# Altium project Crawler_Brain.PrjPcb
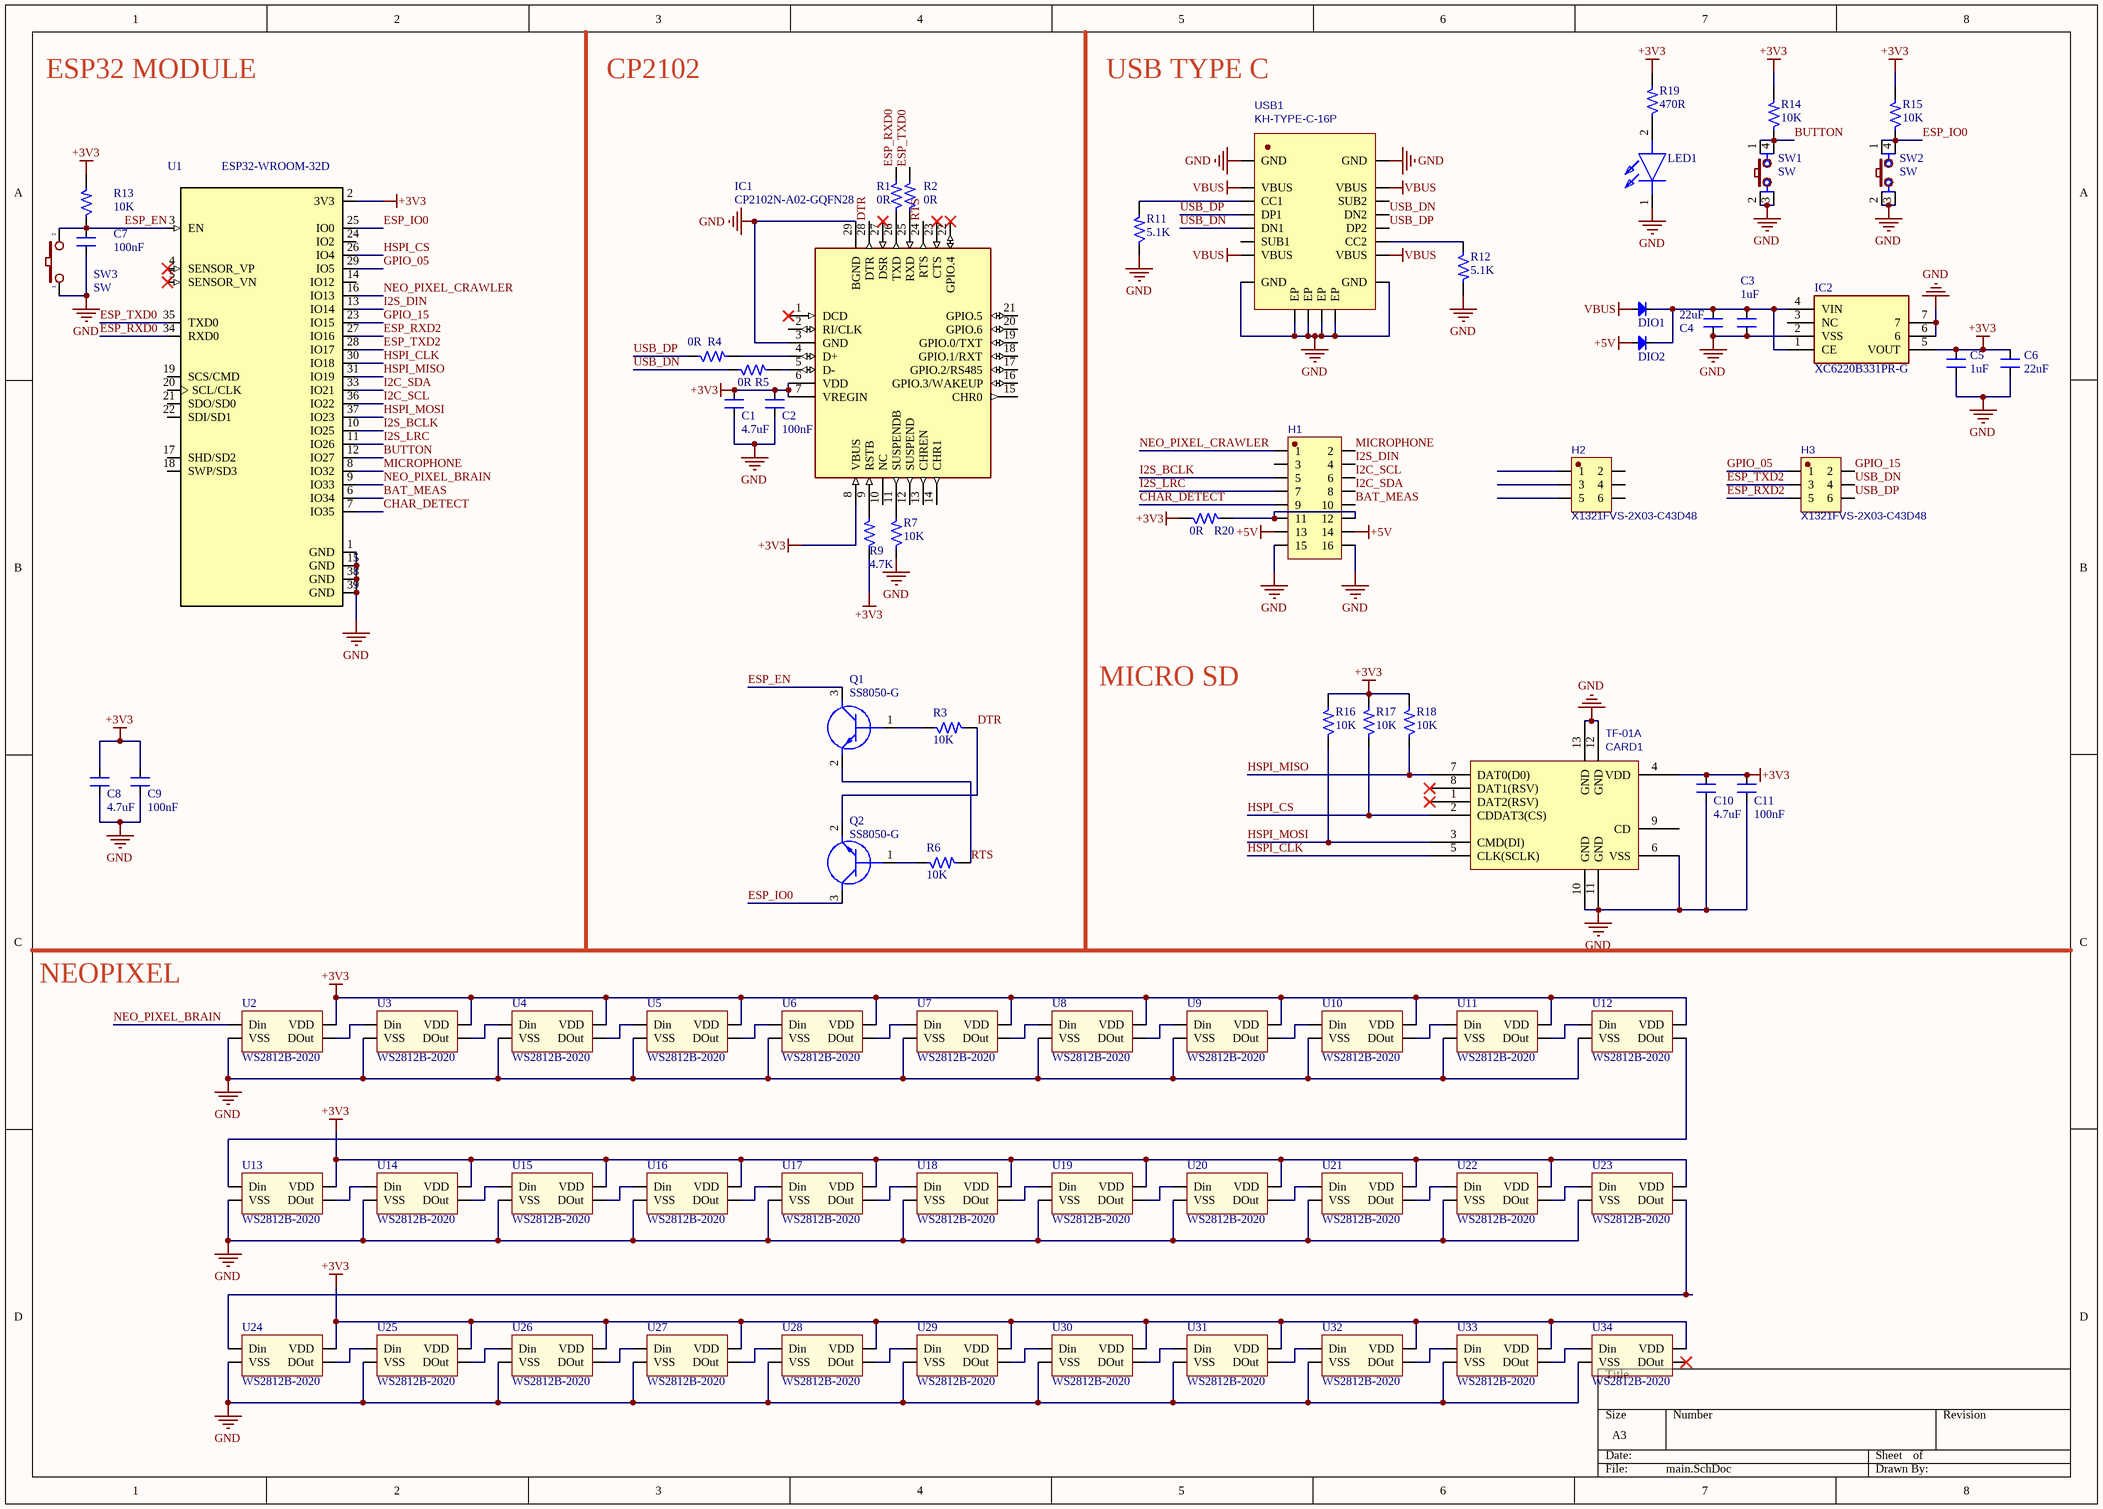
[diagram p0: main.SchDoc]
1 sheet, 78 parts. Net scope: global (net labels, ports and power ports of the same name join across sheets).
Board file: Crawler_Brain.PcbDoc

## Sheet main.SchDoc
size A3; SheetNumber: 1; SheetTotal: 1

### Parts
C1  4.7uF  [CAP_0402]
C2  100nF  [CAP_0402]
C3  1uF  [CAP_0402]
C4  22uF  [CAP_0603]
C5  1uF  [CAP_0402]
C6  22uF  [CAP_0603]
C7  100nF  [CAP_0402]
C8  4.7uF  [CAP_0402]
C9  100nF  [CAP_0402]
C10  4.7uF  [CAP_0402]
C11  100nF  [CAP_0402]
CARD1  TF-01A  [TF-SMD_TF-01A]
DIO1  Diode SMD  [DIO-SMD-123]  (value not drawn)
DIO2  Diode SMD  [DIO-SMD-123]  (value not drawn)
H1  X1321FVS-2X08-C43D48  [HDR-SMD_16P-P1.27-V-F-R2-C8-LS4.8]  (value not drawn)
H2  X1321FVS-2X03-C43D48  [HDR-SMD_6P-P1.27-V-F-R2-C3-LS4.8]
H3  X1321FVS-2X03-C43D48  [HDR-SMD_6P-P1.27-V-F-R2-C3-LS4.8]
IC1  CP2102N-A02-GQFN28  [QFN50P500X500X80-29N]
IC2  XC6220B331PR-G  [XC6220B331PRG]
LED1  LTST-C190KRKT  [LEDC1608X80N]  (value not drawn)
Q1  SS8050-G  [SOT95P240X115-3N]
Q2  SS8050-G  [SOT95P240X115-3N]
R1  0R  [RES_0402]
R2  0R  [RES_0402]
R3  10K  [RES_0402]
R4  0R  [RES_0402]
R5  0R  [RES_0402]
R6  10K  [RES_0402]
R7  10K  [RES_0402]
R9  4.7K  [RES_0402]
R11  5.1K  [RES_0402]
R12  5.1K  [RES_0402]
R13  10K  [RES_0402]
R14  10K  [RES_0402]
R15  10K  [RES_0402]
R16  10K  [RES_0402]
R17  10K  [RES_0402]
R18  10K  [RES_0402]
R19  470R  [RES_0402]
R20  0R  [RES_0603]
SW1  SW  [SW2-DIP]
SW2  SW  [SW2-DIP]
SW3  SW  [SW1-SMD]
U1  ESP32-WROOM-32D  [ESP32WROOM32D16MB]
U2  WS2812B-2020  [WS2812-2020]
U3  WS2812B-2020  [WS2812-2020]
U4  WS2812B-2020  [WS2812-2020]
U5  WS2812B-2020  [WS2812-2020]
U6  WS2812B-2020  [WS2812-2020]
U7  WS2812B-2020  [WS2812-2020]
U8  WS2812B-2020  [WS2812-2020]
U9  WS2812B-2020  [WS2812-2020]
U10  WS2812B-2020  [WS2812-2020]
U11  WS2812B-2020  [WS2812-2020]
U12  WS2812B-2020  [WS2812-2020]
U13  WS2812B-2020  [WS2812-2020]
U14  WS2812B-2020  [WS2812-2020]
U15  WS2812B-2020  [WS2812-2020]
U16  WS2812B-2020  [WS2812-2020]
U17  WS2812B-2020  [WS2812-2020]
U18  WS2812B-2020  [WS2812-2020]
U19  WS2812B-2020  [WS2812-2020]
U20  WS2812B-2020  [WS2812-2020]
U21  WS2812B-2020  [WS2812-2020]
U22  WS2812B-2020  [WS2812-2020]
U23  WS2812B-2020  [WS2812-2020]
U24  WS2812B-2020  [WS2812-2020]
U25  WS2812B-2020  [WS2812-2020]
U26  WS2812B-2020  [WS2812-2020]
U27  WS2812B-2020  [WS2812-2020]
U28  WS2812B-2020  [WS2812-2020]
U29  WS2812B-2020  [WS2812-2020]
U30  WS2812B-2020  [WS2812-2020]
U31  WS2812B-2020  [WS2812-2020]
U32  WS2812B-2020  [WS2812-2020]
U33  WS2812B-2020  [WS2812-2020]
U34  WS2812B-2020  [WS2812-2020]
USB1  KH-TYPE-C-16P  [USB-C-SMD_KH-TYPE-C-16P]

### Nets
+3V3: C1.2 C2.2 C5.2 C6.2 C8.2 C9.2 C10.2 C11.2 CARD1.4(VDD) IC1.6(VDD) IC1.7(VREGIN) IC1.8(VBUS) IC2.5(VOUT) R9.1 R13.2 R14.2 R15.2 R16.2 R17.2 R18.2 R19.2 R20.1 U1.2(3V3) U2.1(VDD) U3.1(VDD) U4.1(VDD) U5.1(VDD) U6.1(VDD) U7.1(VDD) U8.1(VDD) U9.1(VDD) U10.1(VDD) U11.1(VDD) U12.1(VDD) U13.1(VDD) U14.1(VDD) U15.1(VDD) U16.1(VDD) U17.1(VDD) U18.1(VDD) U19.1(VDD) U20.1(VDD) U21.1(VDD) U22.1(VDD) U23.1(VDD) U24.1(VDD) U25.1(VDD) U26.1(VDD) U27.1(VDD) U28.1(VDD) U29.1(VDD) U30.1(VDD) U31.1(VDD) U32.1(VDD) U33.1(VDD) U34.1(VDD)
+5V: DIO2.1(A) H1.13 H1.14
GND: C1.1 C2.1 C3.1 C4.1 C5.1 C6.1 C7.1 C8.1 C9.1 C10.1 C11.1 CARD1.6(VSS) CARD1.10(GND) CARD1.11(GND) CARD1.12(GND) CARD1.13(GND) H1.15 H1.16 IC1.3(GND) IC1.29(BGND) IC2.2(VSS) IC2.6 IC2.7 LED1.1(K) R7.1 R11.1 R12.2 SW1.2 SW1.3 SW2.2 SW2.3 SW3.1 U1.1(GND) U1.15(GND) U1.38(GND) U1.39(GND) U2.3(VSS) U3.3(VSS) U4.3(VSS) U5.3(VSS) U6.3(VSS) U7.3(VSS) U8.3(VSS) U9.3(VSS) U10.3(VSS) U11.3(VSS) U12.3(VSS) U13.3(VSS) U14.3(VSS) U15.3(VSS) U16.3(VSS) U17.3(VSS) U18.3(VSS) U19.3(VSS) U20.3(VSS) U21.3(VSS) U22.3(VSS) U23.3(VSS) U24.3(VSS) U25.3(VSS) U26.3(VSS) U27.3(VSS) U28.3(VSS) U29.3(VSS) U30.3(VSS) U31.3(VSS) U32.3(VSS) U33.3(VSS) U34.3(VSS) USB1.1(EP) USB1.2(EP) USB1.3(EP) USB1.4(EP) USB1.A1(GND) USB1.A12(GND) USB1.B1(GND) USB1.B12(GND)
VBUS: DIO1.1(A) USB1.A4(VBUS) USB1.A9(VBUS) USB1.B4(VBUS) USB1.B9(VBUS)
BAT_MEAS: H1.10 U1.6(IO34)
BUTTON: R14.1 SW1.1 SW1.4 U1.12(IO27)
CHAR_DETECT: H1.9 U1.7(IO35)
DTR: IC1.28(DTR) Q2.2(E) R3.2
ESP_EN: C7.2 Q1.3(C) R13.1 SW3.2 U1.3(EN)
ESP_IO0: Q2.3(C) R15.1 SW2.1 SW2.4 U1.25(IO0)
ESP_RXD0: R1.2 U1.34(RXD0)
ESP_RXD2: H3.5 U1.27(IO16)
ESP_TXD0: R2.2 U1.35(TXD0)
ESP_TXD2: H3.3 U1.28(IO17)
GPIO_05: H3.1 U1.29(IO5)
GPIO_15: H3.2 U1.23(IO15)
HSPI_CLK: CARD1.5(CLK(SCLK)) U1.30(IO18)
HSPI_CS: CARD1.2(CDDAT3(CS)) R17.1 U1.26(IO4)
HSPI_MISO: CARD1.7(DAT0(D0)) R18.1 U1.31(IO19)
HSPI_MOSI: CARD1.3(CMD(DI)) R16.1 U1.37(IO23)
I2C_SCL: H1.6 U1.36(IO22)
I2C_SDA: H1.8 U1.33(IO21)
I2S_BCLK: H1.5 U1.10(IO25)
I2S_DIN: H1.4 U1.13(IO14)
I2S_LRC: H1.7 U1.11(IO26)
MICROPHONE: H1.2 U1.8(IO32)
NEO_PIXEL_BRAIN: U1.9(IO33) U2.4(Din)
NEO_PIXEL_CRAWLER: H1.1 U1.16(IO13)
RTS: IC1.24(RTS) Q1.2(E) R6.2
USB_DN: H3.4 R5.1 USB1.A7(DN1) USB1.B7(DN2)
USB_DP: H3.6 R4.1 USB1.A6(DP1) USB1.B6(DP2)
NetC3_2: C3.2 C4.2 DIO1.2(K) DIO2.2(K) IC2.1(CE) IC2.4(VIN)
NetH1_11: H1.11 H1.12 R20.2
NetIC1_4: IC1.4(D+) R4.2
NetIC1_5: IC1.5(D-) R5.2
NetIC1_9: IC1.9(RSTB) R9.2
NetIC1_11: IC1.11(SUSPENDB) R7.2
NetIC1_25: IC1.25(RXD) R2.1
NetIC1_26: IC1.26(TXD) R1.1
NetLED1_2: LED1.2(A) R19.1
NetQ1_1: Q1.1(B) R3.1
NetQ2_1: Q2.1(B) R6.1
NetR11_2: R11.2 USB1.A5(CC1)
NetR12_1: R12.1 USB1.B5(CC2)
NetU2_2: U2.2(DOut) U3.4(Din)
NetU3_2: U3.2(DOut) U4.4(Din)
NetU4_2: U4.2(DOut) U5.4(Din)
NetU5_2: U5.2(DOut) U6.4(Din)
NetU6_2: U6.2(DOut) U7.4(Din)
NetU7_2: U7.2(DOut) U8.4(Din)
NetU8_2: U8.2(DOut) U9.4(Din)
NetU9_2: U9.2(DOut) U10.4(Din)
NetU10_2: U10.2(DOut) U11.4(Din)
NetU11_2: U11.2(DOut) U12.4(Din)
NetU12_2: U12.2(DOut) U13.4(Din)
NetU13_2: U13.2(DOut) U14.4(Din)
NetU14_2: U14.2(DOut) U15.4(Din)
NetU15_2: U15.2(DOut) U16.4(Din)
NetU16_2: U16.2(DOut) U17.4(Din)
NetU17_2: U17.2(DOut) U18.4(Din)
NetU18_2: U18.2(DOut) U19.4(Din)
NetU19_2: U19.2(DOut) U20.4(Din)
NetU20_2: U20.2(DOut) U21.4(Din)
NetU21_2: U21.2(DOut) U22.4(Din)
NetU22_2: U22.2(DOut) U23.4(Din)
NetU23_2: U23.2(DOut) U24.4(Din)
NetU24_2: U24.2(DOut) U25.4(Din)
NetU25_2: U25.2(DOut) U26.4(Din)
NetU26_2: U26.2(DOut) U27.4(Din)
NetU27_2: U27.2(DOut) U28.4(Din)
NetU28_2: U28.2(DOut) U29.4(Din)
NetU29_2: U29.2(DOut) U30.4(Din)
NetU30_2: U30.2(DOut) U31.4(Din)
NetU31_2: U31.2(DOut) U32.4(Din)
NetU32_2: U32.2(DOut) U33.4(Din)
NetU33_2: U33.2(DOut) U34.4(Din)

Not connected (* = marked no-connect by the designer): CARD1 1(DAT2(RSV))* 8(DAT1(RSV))* 9(CD); H1 3; H2 1 2 3 4 5 6; IC1 1(DCD)* 2(RI/CLK) 10(NC) 12(SUSPEND) 13(CHREN) 14(CHR1) 15(CHR0) 16(GPIO.3/WAKEUP) 17(GPIO.2/RS485) 18(GPIO.1/RXT) 19(GPIO.0/TXT) 20(GPIO.6) 21(GPIO.5) 22(GPIO.4)* 23(CTS)* 27(DSR)*; IC2 3(NC); U1 4(SENSOR_VP)* 5(SENSOR_VN)* 14(IO12) 17(SHD/SD2) 18(SWP/SD3) 19(SCS/CMD) 20(SCL/CLK) 21(SDO/SD0) 22(SDI/SD1) 24(IO2); U34 2(DOut)*; USB1 A8(SUB1) B8(SUB2)

### Notes on the sheet
- ESP32 MODULE
- CP2102
- USB TYPE C
- MICRO SD
- NEOPIXEL

### Library data of the parts
C1 C8 C10 = CAP_4.7uF-10V-10%-0402: 4.7µF ±10% 10V Ceramic Capacitor X5R 0402 (1005 Metric); Manufacturer: Samsung Electro-Mechanics; Manufacturer Part Number: CL05A475KP5NRNC; Case/Package: 0402; Supplier-1: Digikey
C2 C7 C9 C11 = CAP_100nF-10V-10%-0402: 0.1µF ±10% 10V Ceramic Capacitor X7R 0402 (1005 Metric); Manufacturer: Yageo; Manufacturer Part Number: CC0402KRX7R6BB104; Case/Package: 0402; Supplier-1: Digikey
C3 C5 = CAP_1uF-10V-10%-0402: 1µF ±10% 10V Ceramic Capacitor X6S 0402 (1005 Metric); Manufacturer: Murata Electronics; Manufacturer Part Number: GRT155C81A105KE01D; Case/Package: 0402; Supplier-1: Digikey
C4 C6 = CAP_22uF-10V-20%-0603: 22µF ±20% 10V Ceramic Capacitor X5R 0603 (1608 Metric); Manufacturer: Murata Electronics; Manufacturer Part Number: GRM188R61A226ME15D; Case/Package: 0603; Supplier-1: Digikey
CARD1 = TF-01A: BOM_Manufacturer: 韩国韩荣; BOM_Supplier: LCSC; BOM_Manufacturer Part: TF-01A; BOM_Supplier Part: C91145; BOM_JLCPCB Part Class: Extended Part; spicePre: C; spiceSymbolName: TF-01A
DIO1 DIO2 = Diode SMD: Default Diode; Code - JEDEC: DO-214-AB; Value: 1N5007; Published: 8-Jun-2000; Revision: July-2002: Re-released for DXP Platform.; Publisher: Altium Limited
H1 = X1321FVS-2X08-C43D48: BOM_Manufacturer: XKB Connectivity(中国星坤); Contributor: LCSC; BOM_Supplier: LCSC; BOM_Supplier Part: C2684736; BOM_Manufacturer Part: X1321FVS-2x08-C43D48; BOM_JLCPCB Part Class: Extended Part; spicePre: H; spiceSymbolName: X1321FVS-2X08-C43D48
H2 H3 = X1321FVS-2X03-C43D48: BOM_Manufacturer: XKB Connectivity(中国星坤); Contributor: LCSC; BOM_Supplier: LCSC; BOM_Supplier Part: C2684731; BOM_Manufacturer Part: X1321FVS-2x03-C43D48; BOM_JLCPCB Part Class: Extended Part; spicePre: H; spiceSymbolName: X1321FVS-2X03-C43D48
IC1 = CP2102N-A02-GQFN28: Integrated Circuit; Manufacturer_Name: Silicon Labs; Datasheet Link: https://componentsearchengine.com//CP2102N-A02-GQFN28.pdf; Height: 0.8mm; Mouser2 Part Number: 634-CP2102NA02GQFN28; Mouser2 Price/Stock: https://www.mouser.com/Search/Refine.aspx?Keyword=634-CP2102NA02GQFN28; Manufacturer_Part_Number: CP2102N-A02-GQFN28
IC2 = XC6220B331PR-G: Integrated Circuit; Manufacturer_Name: Torex; Datasheet Link: https://www.torexsemi.com/file/xc6220/XC6220.pdf; Height: 1.6mm; Manufacturer_Part_Number: XC6220B331PR-G; Mouser Part Number: 865-XC6220B331PR-G; Mouser Price/Stock: https://www.mouser.co.uk/ProductDetail/Torex-Semiconductor/XC6220B331PR-G?qs=AsjdqWjXhJ9%2FMkHVs5v3gw%3D%3D
LED1 = LTST-C190KRKT: LED RED; Manufacturer_Name: Lite-On; Datasheet Link: https://componentsearchengine.com/Datasheets/1/LTST-C190KRKT.pdf; Height: 0.8mm; Manufacturer_Part_Number: LTST-C190KRKT; Mouser Part Number: 859-LTST-C190KRKT; Mouser Price/Stock: https://www.mouser.co.uk/ProductDetail/Lite-On/LTST-C190KRKT?qs=kAD5fFa1n5VY3YYNWPC1Fg%3D%3D; Arrow Part Number: LTST-C190KRKT; Arrow Price/Stock: https://www.arrow.com/en/products/ltst-c190krkt/lite-on-technology?region=europe
Q1 Q2 = SS8050-G: Transistor BJT NPN; Manufacturer_Name: Comchip Technology; Datasheet Link: https://componentsearchengine.com//SS8050-G.pdf; Height: 1.15mm; Mouser2 Part Number: 750-SS8050-G; Mouser2 Price/Stock: https://www.mouser.com/Search/Refine.aspx?Keyword=750-SS8050-G; Manufacturer_Part_Number: SS8050-G
R1 R2 R4 R5 = RES_0R-0.1W-1%-0402: 0 Ohms Jumper 0.1W, 1/10W Chip Resistor 0402 (1005 Metric) Automotive AEC-Q200 Thick Film; Manufacturer: Panasonic Electronic Components; Manufacturer Part Number: ERJ-2GE0R00X; Case/Package: 0402; Supplier-1: Digikey
R3 R6 R7 R13-R18 = RES_10K-0.1W-1%-0402: 10 kOhms ±1% 0.1W, 1/10W Chip Resistor 0402 (1005 Metric) Anti-Sulfur Thin Film; Manufacturer: Vishay Beyschlag/Draloric/BC Components; Manufacturer Part Number: MCS04020C1002FE000; Case/Package: 0402; Supplier-1: Digikey
R9 = RES_4.7K-0.1W-1%-0402: 4.7 kOhms ±1% 0.1W, 1/10W Chip Resistor 0402 (1005 Metric) Automotive AEC-Q200 Thick Film; Manufacturer: Panasonic Electronic Components; Manufacturer Part Number: ERJ-2RKF4701X; Case/Package: 0402; Supplier-1: Digikey
R11 R12 = RES_5.6K-0.1W-1%-0402: 5.1 kOhms ±1% 0.1W, 1/10W Chip Resistor 0402 (1005 Metric) Automotive AEC-Q200, Moisture Resistant Thick Film; Manufacturer: KOA Speer Electronics, Inc.; Manufacturer Part Number: RK73H1ETTP5601F; Case/Package: 0402; Supplier-1: Digikey
R19 = RES_1K-0.1W-1%-0402: 470 Ohms ±1% 0.1W, 1/10W Chip Resistor 0402 (1005 Metric) Anti-Sulfur Thin Film; Manufacturer: Vishay Beyschlag/Draloric/BC Components; Manufacturer Part Number: MCS04020C1001FE000; Case/Package: 0402; Supplier-1: Digikey
R20 = RES_0R-0.1W-1%-0603: 0 Ohms Jumper 0.1W, 1/10W Chip Resistor 0603 (1608 Metric) Thick Film; Manufacturer: Yageo; Manufacturer Part Number: RC0603JR-070RL; Case/Package: 0603; Supplier-1: Digikey
SW1 SW2 = SW4: Switch button 4 pin; Value: Button chip 4 pin
SW3 = SW2: Switch button 2 pin; Value: SW chip 2 pin
U1 = ESP32-WROOM-32D: IC: SoC; GPIO, I2C, I2S, IR, SD, SDIO, SPI, UART; 2.7Ã·3.6VDC; 20dBm; MF: Espressif Systems; Price: None; SnapEDA_Link: https://www.snapeda.com/parts/ESP32-WROOM-32D/Espressif%20Systems/view-part/?ref=snap; Availability: Unavailable; MP: ESP32-WROOM-32D; Package: Module Espressif Systems; Value: *
U2-U34 = WS2812B
USB1 = KH-TYPE-C-16P: BOM_Manufacturer: kinghelm(金航标); Contributor: LCSC; BOM_Supplier: LCSC; BOM_Supplier Part: C709357; BOM_Manufacturer Part: KH-TYPE-C-16P; BOM_JLCPCB Part Class: Extended Part; spicePre: U; spiceSymbolName: KH-TYPE-C-16P